# EAGLE design ir (EAGLE 7.6.0)
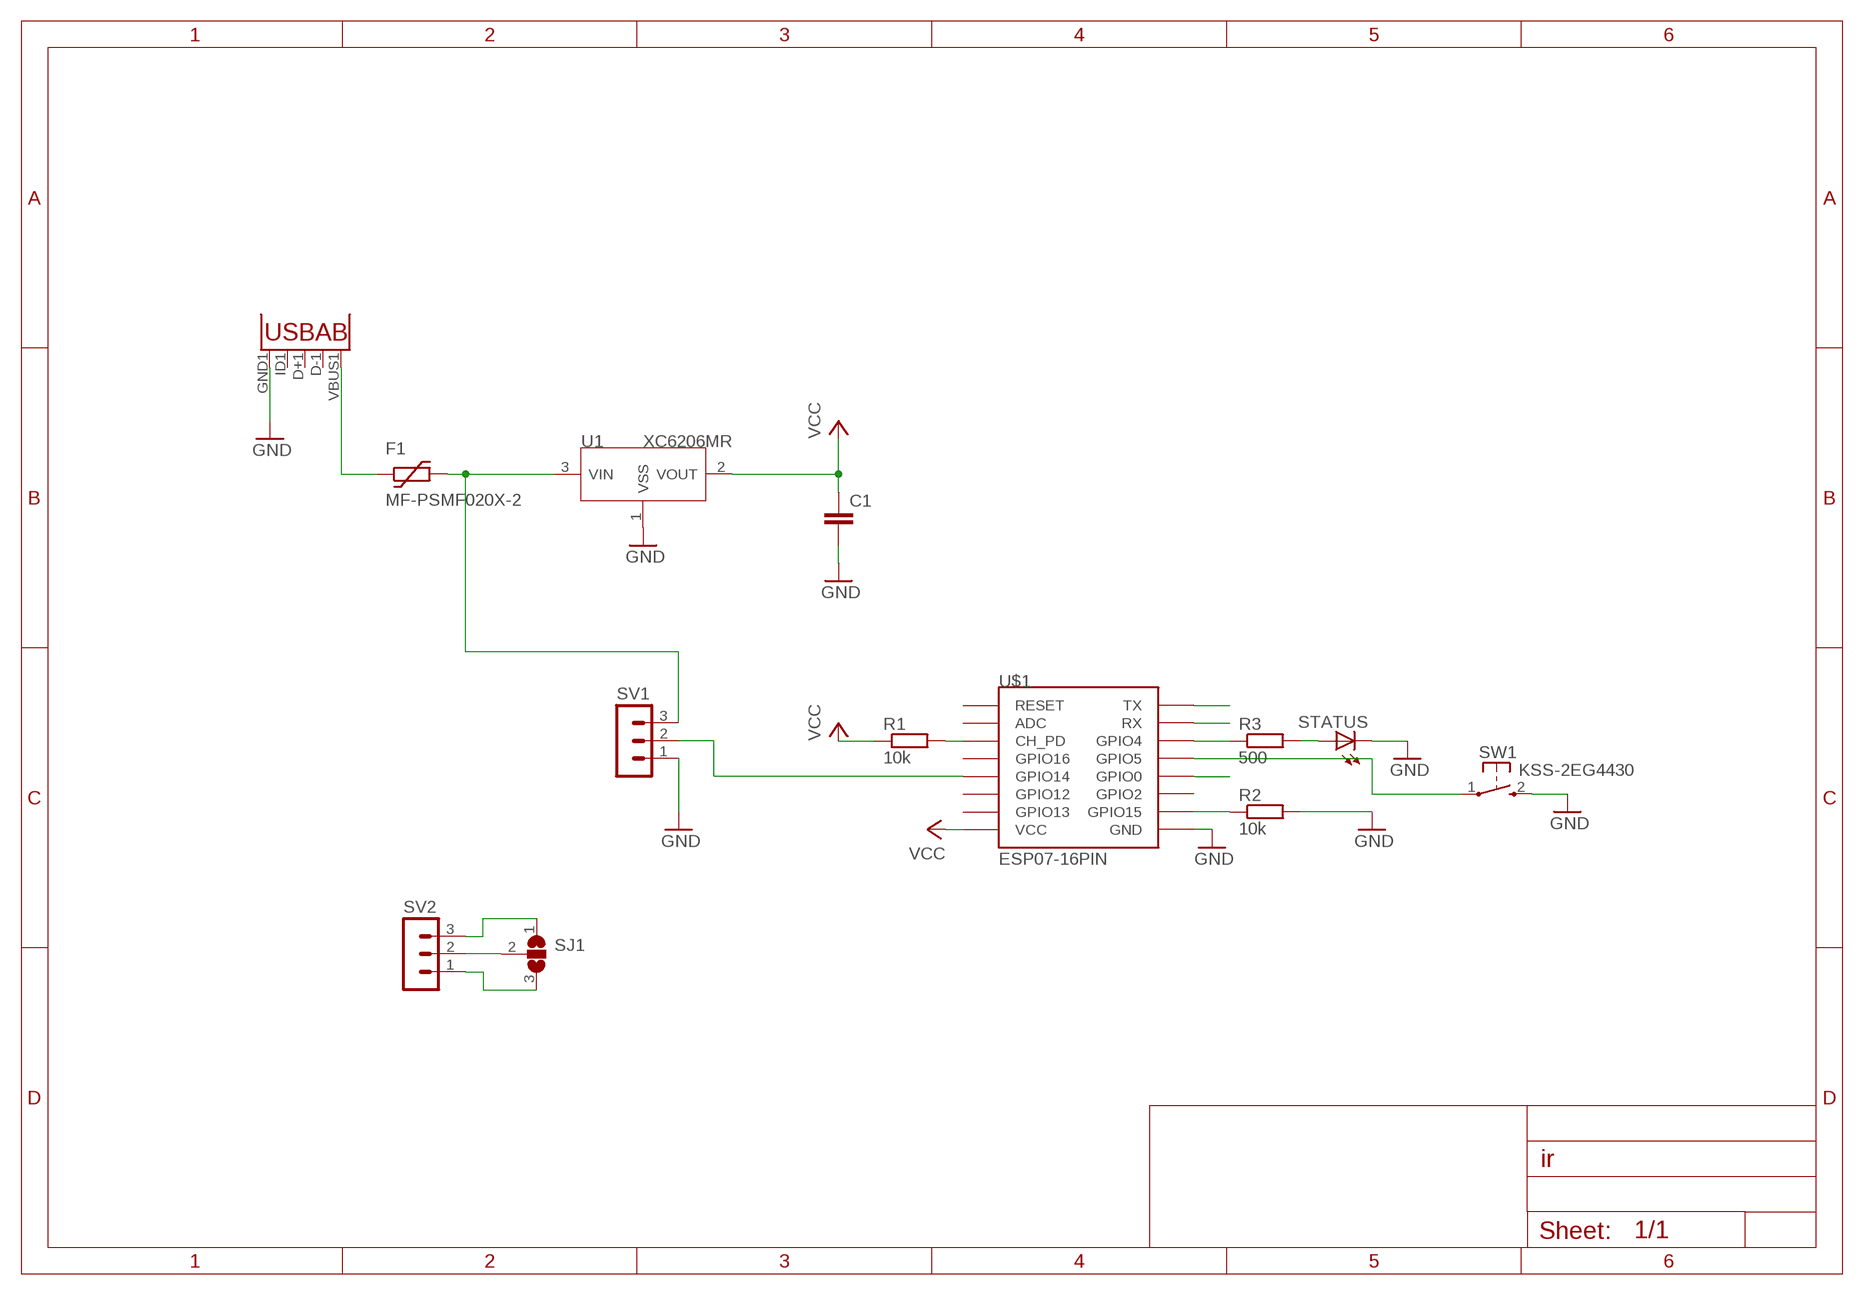
[diagram p0: schematic, sheet 1]

## Parts
C1  C-EUC0805  [C0805]
F1  MF-PSMF020X-2  [0805L]
R1  10k  R-EU_R0805  [R0805]
R2  10k  R-EU_R0805  [R0805]
R3  500  R-EU_R0805  [R0805]
SJ1  SJ2W  [SJ_2]
STATUS  LEDCHIPLED_0805  [CHIPLED_0805]
SV1  MA03-1  [MA03-1]
SV2  MA03-1  [MA03-1]
SW1  KSS-2EG4430  [KSS-2EG4430]
U1  XC6206MR  [SOT23]
U2  USB""  [USB-MICRO-SMD]
U$1  ESP07-16PIN  [ESP07-16PIN]

## Nets
FLASH: U$1.GPIO0
GND: C1.2 R2.2 STATUS.C SV1.1 SW1.2(S) U1.1(VSS) U2.GND1(GND) U$1.GND
N$1: R1.2 U$1.CH_PD
N$2: R2.1 U$1.GPIO15
N$3: F1.2 SV1.3 U1.3(VIN)
N$4: SW1.1(P) U$1.GPIO5
N$5: F1.1 U2.VBUS1(VBUS)
N$6: SV1.2 U$1.GPIO14
N$7: R3.1 U$1.GPIO4
N$8: R3.2 STATUS.A
N$9: SJ1.2 SV2.2
N$10: SJ1.1 SV2.3
N$11: SJ1.3 SV2.1
RX: U$1.RX
TX: U$1.TX
VCC: C1.1 R1.1 U1.2(VOUT) U$1.VCC
Unconnected: U2.D+1(D+) U2.D-1(D-) U2.ID1(USBID) U$1.ADC U$1.GPIO2 U$1.GPIO12 U$1.GPIO13 U$1.GPIO16 U$1.REST(RESET)

## Library data of the parts
C1 = rcl:C-EU: CAPACITOR, European symbol
F1 = ptc-littlefuse:MF-PSMF020X-2: MF-PSMF020X-2 Предохранитель самовосстанавливающийся, 0.2А, 0805 SMD.
R1-R3 = resistor:R-EU_: RESISTOR, European symbol
SJ1 = jumper:SJ2W: SMD solder JUMPER
STATUS = led:LED: LED OSRAM: - CHIPLED LG R971, LG N971, LY N971, LG Q971, LY Q971, LO R971, LY R971 LH N974, LH R974 LS Q976, LO Q976, LY Q976 LO Q996 - Hyper CHIPLED LW Q18S LB Q993, LB Q99A, LB R99A - SideLED LS A670, LO A670, LY A670, LG A670, LP A670 LB A673, LV A673, LT A673, LW A673 LH A674 LY A675 LS A676, LA A676, LO A676, LY A676, LW A676 LS A679, LY A679, LG A679 - Hyper Micro SIDELED® LS Y876, LA Y876, LO Y876, LY Y876 LT Y87S - SmartLED LW L88C, LW L88S LB L89C, LB L89S, LG L890 LS L89K, LO L89K, LY L89K LS L896, LA L896, LO L896, LY L896 - TOPLED LS T670, LO T670, LY T670, LG T670, LP T670 LSG T670, LSP T670, LSY T670, LOP T670, LYG T670 LG T671, LOG T671, LSG T671 LB T673, LV T673, LT T673, LW T673 LH T674 LS T676, LA T676, LO T676, LY T676, LB T676, LH T676, LSB T676, LW T676 LB T67C, LV T67C, LT T67C, LS T67K, LO T67K, LY T67K, LW E67C LS E67B, LA E67B, LO E67B, LY E67B, LB E67C, LV E67C, LT E67C LW T67C LS T679, LY T679, LG T679 LS T770, LO T770, LY T770, LG T770, LP T770 LB T773, LV T773, LT T773, LW T773 LH T774 LS E675, LA E675, LY E675, LS T675 LS T776, LA T776, LO T776, LY T776, LB T776 LHGB T686 LT T68C, LB T68C - Hyper Mini TOPLED® LB M676 - Mini TOPLED Santana® LG M470 LS M47K, LO M47K, LY M47K Source: http://www.osram.convergy.de LUXEON: - LUMILED® LXK2-PW12-R00, LXK2-PW12-S00, LXK2-PW14-U00, LXK2-PW14-V00 LXK2-PM12-R00, LXK2-PM12-S00, LXK2-PM14-U00 LXK2-PE12-Q00, LXK2-PE12-R00, LXK2-PE12-S00, LXK2-PE14-T00, LXK2-PE14-U00 LXK2-PB12-K00, LXK2-PB12-L00, LXK2-PB12-M00, LXK2-PB14-N00, LXK2-PB14-P00, LXK2-PB14-Q00 LXK2-PR12-L00, LXK2-PR12-M00, LXK2-PR14-Q00, LXK2-PR14-R00 LXK2-PD12-Q00, LXK2-PD12-R00, LXK2-PD12-S00 LXK2-PH12-R00, LXK2-PH12-S00 LXK2-PL12-P00, LXK2-PL12-Q00, LXK2-PL12-R00 Source: www.luxeon.com KINGBRIGHT: KA-3528ASYC Source: www.kingbright.com
SV1 SV2 = con-lstb:MA03-1: PIN HEADER; OC_FARNELL: unknown; OC_NEWARK: unknown
SW1 = buttons:KSS-2EG4430: Size: 3x6mm Height: 5mm from PCB Rating: DC12v 50mA Travel: 0.25±0.10mm Operating Force: 180±50gf Return Force: 60gf min Contact resistance: 100m? max Insulation resistance: 100M? min Operating life?50,000 cycles
U1 = IC:XC6206: LOW ESR Cap.Compatible Positive Voltage Regulators
U2 = MicroUSB:USB: This is a USB AB connector that is compatible with USB OTG. i.e. this connector can serve as a host or device
U$1 = esp8266modules:ESP07-16PIN: ESP8266 Wifi module 07 - 16 pins; DIMENSIONS: 22.0 x 16.0 mm; PINS: 16; PITCH: 0.078" / 2 mm

## Board
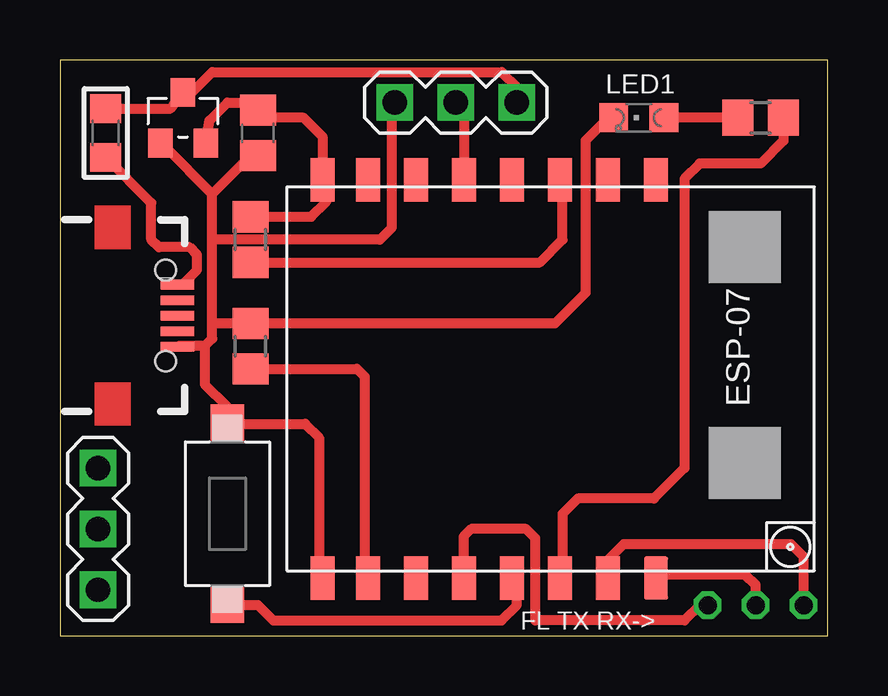
[diagram p1: board, top side]
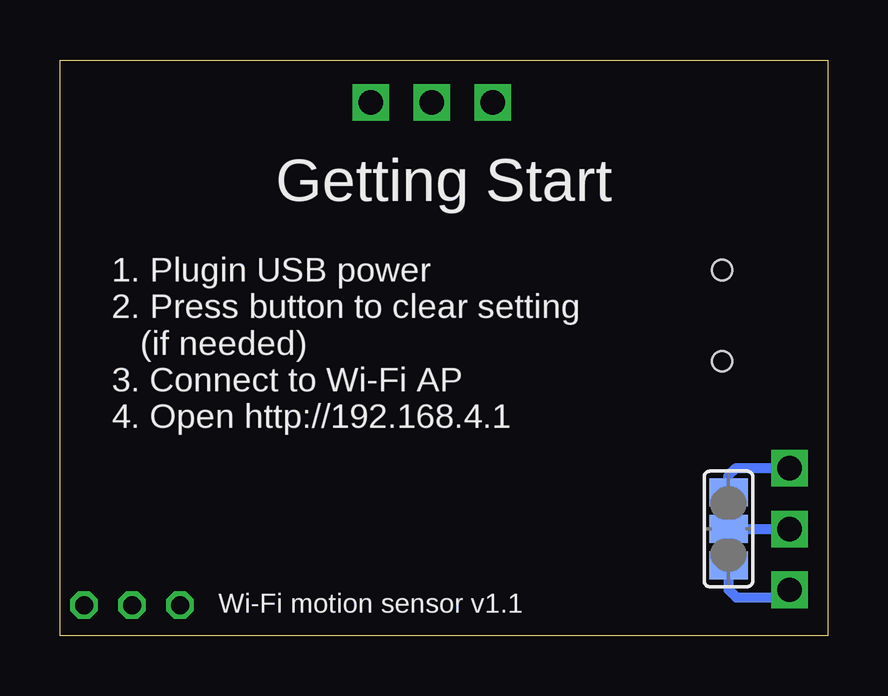
[diagram p2: board, bottom side, seen from below]

Size 32 x 24 mm. Coordinates in mm from the lower left corner, seen from the top.
Outline: 0,0 32,0 32,24 0,24 0,0
Copper layers (1*16): Top 0.035mm / dielectric 1.5mm / Bottom 0.035mm
Design rules "default": minimum track width 10mil, minimum drill 24mil, track to track 8mil, track to pad 8mil, pad to pad 8mil, via to via 8mil, smd to smd 8mil, copper to edge 40mil, drill to drill 8mil, minimum pad ring 10mil, minimum via ring 8mil, stop-mask expansion 4mil, vias tented up to drill 0mil, thermal gap 10mil

### Footprints (pad centres in the part's own frame; a part is rotated, then mirrored left to right if it is on the bottom)
C0805 = smd 1.3 x 1.5: 1 -0.95,0; 2 0.95,0
0805L = smd 1.2 x 1.3: 1 -1.016,0; 2 1.016,0
R0805 = smd 1.3 x 1.5: 1 -0.95,0; 2 0.95,0
SJ_2 = smd 1.168 x 1.6: 1 -1.524,0; 2 0,0; 3 1.524,0
CHIPLED_0805 = smd 1.2 x 1.2: A 0,-1.05; C 0,1.05
MA03-1 = drill 1.016 square: 1 -2.54,0; 2 0,0; 3 2.54,0
KSS-2EG4430 = smd 1.6 x 1.4: 1 -3.75,0; 2 3.75,0
SOT23 = smd 1.016 x 1.2: 1 -0.95,-1.06; 2 0.95,-1.06; 3 0,1.06
USB-MICRO-SMD = smd 1.4 x 0.4: D+1 2.7,0; D-1 2.7,0.65; GND1 2.7,-1.3; ID1 2.7,-0.65; VBUS1 2.7,1.3 | hole 0.85: 2.2,1.9; 2.2,-1.9
ESP07-16PIN = smd 1.8 x 1: ADC -8.3,3.8; CH_PD -8.3,1.8; GND 8.3,-8.105; GPIO0 8.3,-2.2; GPIO2 8.3,-4.2; GPIO4 8.3,1.8; GPIO5 8.3,-0.2; GPIO12 -8.3,-4.2; GPIO13 -8.3,-6.2; GPIO14 -8.3,-2.2; GPIO15 8.3,-6.2; GPIO16 -8.3,-0.2; REST -8.3,5.8; RX 8.3,3.8; TX 8.3,5.8; VCC -8.3,-8.105

### Placement (x,y rotation side)
C1  8.26,20.95 270 top
F1  1.91,20.95 90 top
R1  7.94,16.51 270 top
R2  7.94,12.06 90 top
R3  29.21,21.59 180 top
SJ1  4.13,4.45 270 bottom
STATUS  24.13,21.59 90 top
SV1  16.5,22.23 0 top
SV2  1.59,4.45 90 top
SW1  6.99,5.08 90 top
U1  5.13,21.59 0 top
U2  2.2,13.34 0 top
U$1  19.05,10.7 270 top

### Tracks (layer width: path | path; a pad name or v marks a point on that pad's centre or on a via)
FLASH  (via drill 0.75)
  Top 0.406: v27,1.27 26.67,1.27 26.04,0.64 19.81,0.64 19.81,4.06 19.43,4.45 17.14,4.45 16.83,4.13 16.83,2.42 U$1.GPIO0
GND
  Top 0.406: U1.1 4.33,20.43 6.35,18.41 | C1.2 7.94,20 6.35,18.41 | STATUS.C 22.86,21.59 21.91,20.64 21.91,14.29 20.64,13.02 R2.2 | 6.35,13.02 6.35,12.38 6.03,12.06 | 6.35,13.02 6.35,16.51 | 6.35,16.51 6.35,18.41 | 6.03,12.06 4.93,12.06 U2.GND1 | 6.35,16.51 13.34,16.51 13.84,17.02 13.84,22.11 SV1.1 | 6.03,12.06 6.03,10.48 6.99,9.53 SW1.2 10.22,8.83 10.79,8.26 10.79,2.55 U$1.GND 10.79,2.38 | R2.2 | R2.2 6.35,13.02
N$1
  Top 0.406: R1.2 20,15.56 20.95,16.51 20.95,18.89 U$1.CH_PD 20.95,18.53
N$2
  Top 0.406: 12.7,2.38 U$1.GPIO15 12.7,2.55 12.7,10.79 12.38,11.12 R2.1
N$3
  Top 0.406: F1.2 4.61,21.97 U1.3 5.5,22.65 6.35,23.5 18.41,23.5 19.05,22.86 SV1.3
N$4
  Top 0.406: U$1.GPIO5 19.05,2.04 19.05,1.27 18.41,0.64 8.89,0.64 8.26,1.27 7.04,1.27 SW1.1
N$5
  Top 0.406: U2.VBUS1 5.11,14.63 5.71,15.24 5.71,15.88 5.4,16.19 4.13,16.19 3.81,16.51 3.81,18.03 F1.1
N$6
  Top 0.406: SV1.2 16.85,21.88 U$1.GPIO14
N$7
  Top 0.406: R3.1 30.16,20.64 29.21,19.68 26.67,19.68 26.04,19.05 26.04,6.99 24.77,5.71 21.59,5.71 20.95,5.08 20.95,2.5 U$1.GPIO4 20.95,2.34
N$8
  Top 0.406: R3.2 STATUS.A
N$9
  Bottom 0.406: SJ1.2 SV2.2
N$10
  Bottom 0.406: SJ1.1 4.13,6.67 3.81,6.99 SV2.3
N$11
  Bottom 0.406: SJ1.3 4.13,1.91 3.81,1.59 1.91,1.59 SV2.1
RX  (via drill 0.75)
  Top 0.406: v31,1.27 31,3.29 30.48,3.81 23.5,3.81 22.86,3.17 U$1.RX 22.86,2.25
TX  (via drill 0.75)
  Top 0.406: v29,1.27 29,2.12 28.57,2.54 24.99,2.54 U$1.TX 25.16,2.54
VCC
  Top 0.406: U1.2 6.24,21.48 6.99,22.23 7.93,22.23 C1.1 8.57,21.59 10.16,21.59 10.95,20.8 U$1.VCC 11.11,18.83 11.11,18.1 10.47,17.46 R1.1

### Text on the board
tPlace: LED1 | FL TX RX->
bPlace: Getting Start | 1. Plugin USB power / 2. Press button to clear setting / (if needed) / 3. Connect to Wi-Fi AP / 4. Open http://192.168.4.1 | Wi-Fi motion sensor v1.1